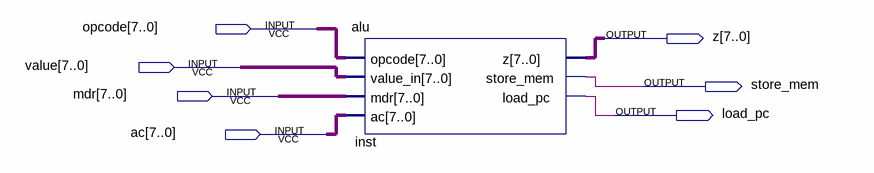
[diagram p0: schematic sheet]
// Quartus schematic alu_sim.bdf as structural Verilog: 1 symbols, 7 pins
module alu_sim (
  input  [7:0] opcode,
  input  [7:0] value,
  input  [7:0] mdr,
  input  [7:0] ac,
  output [7:0] z,
  output store_mem,
  output load_pc
);

  alu inst (.opcode(opcode), .value_in(value), .mdr(mdr), .ac(ac), .z(z), .store_mem(store_mem), .load_pc(load_pc));
endmodule
